# Altium schematic sheet 7-IO_Headers.SchDoc
size 431 x 279 mm; Organization: ORGANIZATION; Address1: ADDRESS 1; Address2: ADDRESS 2; Address3: ADDRESS 3; Address4: ADDRESS 4; DocumentNumber: 7; Revision: -; SheetNumber: 7; SheetTotal: 14; ENG_APP_DATE: --/--/--; DSN_APP_DATE: --/--/--; CHK_APP_DATE: --/--/--
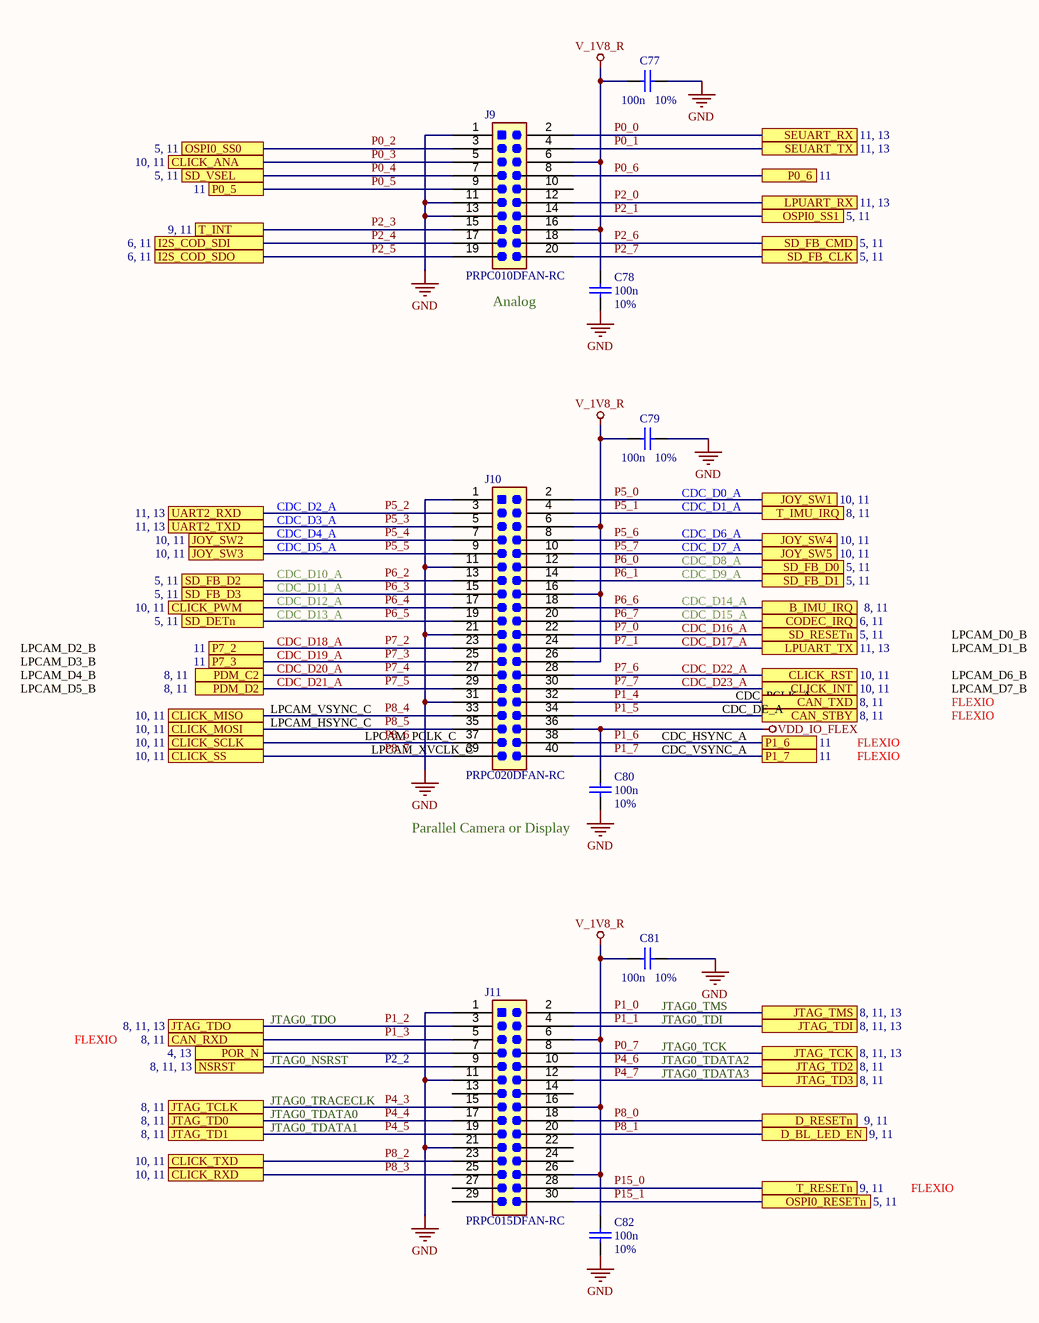
[diagram p0: 7-IO_Headers.SchDoc]

## Parts
C77  value 100n  Tolerance: 10%  [CAPC0402-01]  (hidden comment: Cap)
C78  value 100n  Tolerance: 10%  [CAPC0402-01]  (hidden comment: Cap)
C79  value 100n  Tolerance: 10%  [CAPC0402-01]  (hidden comment: Cap)
C80  value 100n  Tolerance: 10%  [CAPC0402-01]  (hidden comment: Cap)
C81  value 100n  Tolerance: 10%  [CAPC0402-01]  (hidden comment: Cap)
C82  value 100n  Tolerance: 10%  [CAPC0402-01]  (hidden comment: Cap)
J9  PRPC010DFAN-RC  [CON20_2X10_P100UM_HDR_TYC]
J10  PRPC020DFAN-RC  [CON40_2X20_P100UM_HDR_TYC]
J11  PRPC015DFAN-RC  [CON30_2X15_P100UM_HDR_TYC]

## Ports
B_IMU_IRQ (see 8, 11), CAN_RXD (see 8, 11), CAN_STBY (see 8, 11), CAN_TXD (see 8, 11), CLICK_ANA (see 10, 11), CLICK_INT (see 10, 11), CLICK_MISO (see 10, 11), CLICK_MOSI (see 10, 11), CLICK_PWM (see 10, 11), CLICK_RST (see 10, 11), CLICK_RXD (see 10, 11), CLICK_SCLK (see 10, 11), CLICK_SS (see 10, 11), CLICK_TXD (see 10, 11), CODEC_IRQ (see 6, 11), D_BL_LED_EN (see 9, 11), D_RESETn (see 9, 11), I2S_COD_SDI (see 6, 11), I2S_COD_SDO (see 6, 11), JOY_SW1 (see 10, 11), JOY_SW2 (see 10, 11), JOY_SW3 (see 10, 11), JOY_SW4 (see 10, 11), JOY_SW5 (see 10, 11), JTAG_TCK (see 8, 11, 13), JTAG_TCLK (see 8, 11), JTAG_TD0 (see 8, 11), JTAG_TD1 (see 8, 11), JTAG_TD2 (see 8, 11), JTAG_TD3 (see 8, 11), JTAG_TDI (see 8, 11, 13), JTAG_TDO (see 8, 11, 13), JTAG_TMS (see 8, 11, 13), LPUART_RX (see 11, 13), LPUART_TX (see 11, 13), NSRST (see 8, 11, 13), OSPI0_RESETn (see 5, 11), OSPI0_SS0 (see 5, 11), OSPI0_SS1 (see 5, 11), P0_5 (see 11), P0_6 (see 11), P1_6 (see 11), P1_7 (see 11), P7_2 (see 11), P7_3 (see 11), PDM_C2 (see 8, 11), PDM_D2 (see 8, 11), POR_N (see 4, 13), SD_DETn (see 5, 11), SD_FB_CLK (see 5, 11), SD_FB_CMD (see 5, 11), SD_FB_D0 (see 5, 11), SD_FB_D1 (see 5, 11), SD_FB_D2 (see 5, 11), SD_FB_D3 (see 5, 11), SD_RESETn (see 5, 11), SD_VSEL (see 5, 11), SEUART_RX (see 11, 13), SEUART_TX (see 11, 13), T_IMU_IRQ (see 8, 11), T_INT (see 9, 11), T_RESETn (see 9, 11), UART2_RXD (see 11, 13), UART2_TXD (see 11, 13)

## Nets
GND: C77.1 C78.1 C79.1 C80.1 C81.1 C82.1 J9.1 J9.11 J9.13 J10.1 J10.11 J10.21 J10.31 J11.1 J11.11 J11.21
V_1V8_R: C77.2 C78.2 C79.2 C81.2 C82.2 J9.6 J9.16 J10.6 J10.16 J10.26 J11.6 J11.16 J11.26
VDD_IO_FLEX: C80.2 J10.36
NSRST: J11.9 ; port NSRST
P0_0: J9.2 ; port SEUART_RX
P0_1: J9.4 ; port SEUART_TX
P0_2: J9.3 ; port OSPI0_SS0
P0_3: J9.5 ; port CLICK_ANA
P0_4: J9.7 ; port SD_VSEL
P0_5: J9.9 ; port P0_5
P0_6: J9.8 ; port P0_6
P0_7: J11.8 ; port JTAG_TCK
P1_0: J11.2 ; port JTAG_TMS
P1_1: J11.4 ; port JTAG_TDI
P1_2: J11.3 ; port JTAG_TDO
P1_3: J11.5 ; port CAN_RXD
P1_4: J10.32 ; port CAN_TXD
P1_5: J10.34 ; port CAN_STBY
P1_6: J10.38 ; port P1_6
P1_7: J10.40 ; port P1_7
P2_0: J9.12 ; port LPUART_RX
P2_1: J9.14 ; port OSPI0_SS1
P2_3: J9.15 ; port T_INT
P2_4: J9.17 ; port I2S_COD_SDI
P2_5: J9.19 ; port I2S_COD_SDO
P2_6: J9.18 ; port SD_FB_CMD
P2_7: J9.20 ; port SD_FB_CLK
P4_3: J11.15 ; port JTAG_TCLK
P4_4: J11.17 ; port JTAG_TD0
P4_5: J11.19 ; port JTAG_TD1
P4_6: J11.10 ; port JTAG_TD2
P4_7: J11.12 ; port JTAG_TD3
P5_0: J10.2 ; port JOY_SW1
P5_1: J10.4 ; port T_IMU_IRQ
P5_2: J10.3 ; port UART2_RXD
P5_3: J10.5 ; port UART2_TXD
P5_4: J10.7 ; port JOY_SW2
P5_5: J10.9 ; port JOY_SW3
P5_6: J10.8 ; port JOY_SW4
P5_7: J10.10 ; port JOY_SW5
P6_0: J10.12 ; port SD_FB_D0
P6_1: J10.14 ; port SD_FB_D1
P6_2: J10.13 ; port SD_FB_D2
P6_3: J10.15 ; port SD_FB_D3
P6_4: J10.17 ; port CLICK_PWM
P6_5: J10.19 ; port SD_DETn
P6_6: J10.18 ; port B_IMU_IRQ
P6_7: J10.20 ; port CODEC_IRQ
P7_0: J10.22 ; port SD_RESETn
P7_1: J10.24 ; port LPUART_TX
P7_2: J10.23 ; port P7_2
P7_3: J10.25 ; port P7_3
P7_4: J10.27 ; port PDM_C2
P7_5: J10.29 ; port PDM_D2
P7_6: J10.28 ; port CLICK_RST
P7_7: J10.30 ; port CLICK_INT
P8_0: J11.18 ; port D_RESETn
P8_1: J11.20 ; port D_BL_LED_EN
P8_2: J11.23 ; port CLICK_TXD
P8_3: J11.25 ; port CLICK_RXD
P8_4: J10.33 ; port CLICK_MISO
P8_5: J10.35 ; port CLICK_MOSI
P8_6: J10.37 ; port CLICK_SCLK
P8_7: J10.39 ; port CLICK_SS
P15_0: J11.28 ; port T_RESETn
P15_1: J11.30 ; port OSPI0_RESETn
POR_N: J11.7 ; port POR_N

Not connected (* = marked no-connect by the designer): J9 10; J11 13 14 22 24 27 29

## Notes on the sheet
- (near J9) Analog
- CDC_D2_A
- CDC_D3_A
- CDC_D1_A
- CDC_D0_A
- CDC_D4_A
- CDC_D5_A
- CDC_D10_A
- CDC_D6_A
- CDC_D7_A
- CDC_D8_A
- CDC_D9_A
- LPCAM_D2_B
- CDC_D11_A
- CDC_D12_A
- CDC_D13_A
- CDC_D18_A
- CDC_D19_A
- CDC_D14_A
- CDC_D15_A
- CDC_D16_A
- CDC_D17_A
- LPCAM_D1_B
- LPCAM_D0_B
- LPCAM_D3_B
- LPCAM_D4_B
- LPCAM_D5_B
- LPCAM_VSYNC_C
- CDC_D20_A
- CDC_D21_A
- CDC_D22_A
- CDC_D23_A
- CDC_DE_A
- CDC_PCLK_A
- LPCAM_D6_B
- LPCAM_D7_B
- FLEXIO
- LPCAM_HSYNC_C
- LPCAM_PCLK_C
- LPCAM_XVCLK_C
- CDC_VSYNC_A
- CDC_HSYNC_A
- (near C80) Parallel Camera or Display
- JTAG0_NSRST
- JTAG0_TDO
- JTAG0_TDI
- (near C81) JTAG0_TMS
- JTAG0_TCK
- JTAG0_TDATA2
- JTAG0_TRACECLK
- JTAG0_TDATA0
- P2_2
- JTAG0_TDATA3
- JTAG0_TDATA1
- DWG. NO.
- REV
- SHT
- REVISION
- DESCRIPTION
- DATE
- APPROVED
- ENG:
- APPROVALS
- PROJECT
- Suite 300
- Alif Semiconductor
- 7901 Stoneridge Drive
- DSN:
- CHK:
- REFERENCE DOCUMENTS
- TITLE
- Pleasanton, CA 94588  USA
- BOM:
- FAB DWG:
- PCB DWG:
- ASSY DWG:
- SCALE:
- SIZE
- B
- CAGE CODE
- FILE NAME
- DWG NO.
- SHEET
- OF
- none

## Library data of the parts
C77-C82 = Cap: Cap,100nF,10%,50V,X7R,0402; Manufacturer 1: TDK; Manufacturer Part Number 1: C1005X7R1H104K050BE; PCB_Footprint: CC0402; Published: 8-Jun-2000; LatestRevisionDate: 17-Jul-2002; LatestRevisionNote: Re-released for DXP Platform.; PackageReference: RAD-0.3; Publisher: Altium Limited; PackageDescription: Radial Cap, Thru-Hole; 2 Leads; 0.3 in Pin Spacing; Max_Height: 0.60mm; Manufacturer 2: Samsung; Manufacturer Part Number 2: CL05B104KB54PNC; Manufacturer 3: Walsin; Manufacturer Part Number 3: 0402B104K500CT; Type: X7R; Voltage: 50V
J9 = Hdr_M_2X10_2M54_STRT_UNSHROUDED: Hdr, Male,2x10, 0.1"x0.1", Strt,Mate Ht 0.318",Tail Ht 0.120",Unshrouded; Manufacturer 1: Sullins; Manufacturer Part Number 1: PRPC010DFAN-RC; PCB_Footprint: *
J10 = Hdr_M_2X20_2M54_STRT_UNSHROUDED: Hdr, Male,2x20, 0.1"x0.1", Strt,Mate Ht 0.318",Tail Ht 0.120",Unshrouded; Manufacturer 1: Sullins; PCB_Footprint: HDR,2x20,2M54,STRT,UNSHROUD; Manufacturer Part Number 1: PRPC020DFAN-RC
J11 = Hdr_M_2X15_2M54_STRT_UNSHROUDED: Hdr, Male,2x15, 0.1"x0.1", Strt,Mate Ht 0.318",Tail Ht 0.120",Unshrouded; Manufacturer 1: Sullins; Manufacturer Part Number 1: PRPC015DFAN-RC; PCB_Footprint: *